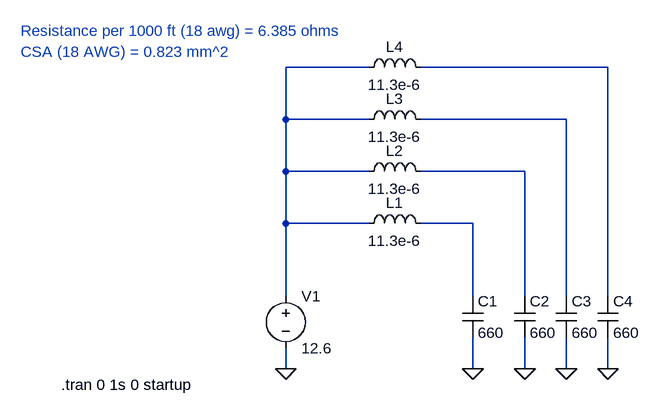
[diagram p0: schematic esc_inrush.asc]
esc_inrush.asc, the LTspice schematic file:
Version 4
SHEET 1 880 680
WIRE 176 -224 48 -224
WIRE 544 -224 256 -224
WIRE 48 -144 48 -224
WIRE 176 -144 48 -144
WIRE 480 -144 256 -144
WIRE 48 -64 48 -144
WIRE 176 -64 48 -64
WIRE 416 -64 256 -64
WIRE 48 16 48 -64
WIRE 176 16 48 16
WIRE 336 16 256 16
WIRE 48 128 48 16
WIRE 336 128 336 16
WIRE 416 128 416 -64
WIRE 480 128 480 -144
WIRE 544 128 544 -224
WIRE 48 240 48 208
WIRE 336 240 336 192
WIRE 416 240 416 192
WIRE 480 240 480 192
WIRE 544 240 544 192
FLAG 48 240 0
FLAG 336 240 0
FLAG 416 240 0
FLAG 480 240 0
FLAG 544 240 0
SYMBOL voltage 48 112 R0
SYMATTR InstName V1
SYMATTR Value 12.6
SYMBOL cap 320 128 R0
SYMATTR InstName C1
SYMATTR Value 660
SYMATTR SpiceLine Rser=0.02
SYMBOL ind 160 32 R270
WINDOW 0 32 56 VTop 2
WINDOW 3 5 56 VBottom 2
SYMATTR InstName L1
SYMATTR Value 11.3e-6
SYMATTR SpiceLine Rser=0.01277
SYMBOL cap 400 128 R0
SYMATTR InstName C2
SYMATTR Value 660
SYMATTR SpiceLine Rser=0.02
SYMBOL cap 464 128 R0
SYMATTR InstName C3
SYMATTR Value 660
SYMATTR SpiceLine Rser=0.02
SYMBOL cap 528 128 R0
SYMATTR InstName C4
SYMATTR Value 660
SYMATTR SpiceLine Rser=0.02
SYMBOL ind 160 -48 R270
WINDOW 0 32 56 VTop 2
WINDOW 3 5 56 VBottom 2
SYMATTR InstName L2
SYMATTR Value 11.3e-6
SYMATTR SpiceLine Rser=0.01277
SYMBOL ind 160 -128 R270
WINDOW 0 32 56 VTop 2
WINDOW 3 5 56 VBottom 2
SYMATTR InstName L3
SYMATTR Value 11.3e-6
SYMATTR SpiceLine Rser=0.01277
SYMBOL ind 160 -208 R270
WINDOW 0 32 56 VTop 2
WINDOW 3 5 56 VBottom 2
SYMATTR InstName L4
SYMATTR Value 11.3e-6
SYMATTR SpiceLine Rser=0.01277
TEXT -360 -280 Left 2 ;Resistance per 1000 ft (18 awg) = 6.385 ohms
TEXT -360 -248 Left 2 ;CSA (18 AWG) = 0.823 mm^2
TEXT -298 264 Left 2 !.tran 0 1s 0 startup

The netlist it stands for:
* esc_inrush.asc
V1 N001 0 12.6
C1 N005 0 660 Rser=0.02
L1 N001 N005 11.3e-6 Rser=0.01277
C2 N004 0 660 Rser=0.02
C3 N003 0 660 Rser=0.02
C4 N002 0 660 Rser=0.02
L2 N001 N004 11.3e-6 Rser=0.01277
L3 N001 N003 11.3e-6 Rser=0.01277
L4 N001 N002 11.3e-6 Rser=0.01277
* Resistance per 1000 ft (18 awg) = 6.385 ohms
* CSA (18 AWG) = 0.823 mm^2
.tran 0 1s 0 startup
.backanno
.end